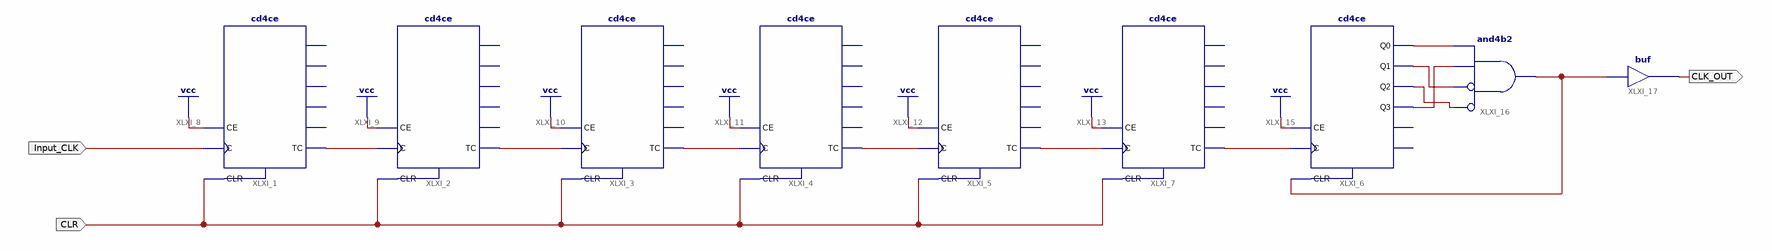
[diagram p0: schematic sheet 1]
// Xilinx ISE schematic Div9M.sch (spartan6) as structural Verilog: 9 symbols, 3 ports
module Div9M (
  input  Input_CLK,
  input  CLR,
  output CLK_OUT
);

  wire XLXN_2, XLXN_3, XLXN_4, XLXN_5, XLXN_6, XLXN_7, XLXN_20, XLXN_21, XLXN_22, XLXN_23, XLXN_24;

  cd4ce XLXI_1 (.C(Input_CLK), .CE(1'b1), .CLR(CLR), .TC(XLXN_2));  // open: CEO, Q0, Q1, Q2, Q3
  cd4ce XLXI_2 (.C(XLXN_2), .CE(1'b1), .CLR(CLR), .TC(XLXN_3));  // open: CEO, Q0, Q1, Q2, Q3
  cd4ce XLXI_3 (.C(XLXN_3), .CE(1'b1), .CLR(CLR), .TC(XLXN_4));  // open: CEO, Q0, Q1, Q2, Q3
  cd4ce XLXI_4 (.C(XLXN_4), .CE(1'b1), .CLR(CLR), .TC(XLXN_5));  // open: CEO, Q0, Q1, Q2, Q3
  cd4ce XLXI_5 (.C(XLXN_5), .CE(1'b1), .CLR(CLR), .TC(XLXN_6));  // open: CEO, Q0, Q1, Q2, Q3
  cd4ce XLXI_6 (
    .C(XLXN_7), .CE(1'b1), .CLR(XLXN_24), .Q0(XLXN_20), .Q1(XLXN_22), .Q2(XLXN_23), .Q3(XLXN_21));  // open: CEO, TC
  cd4ce XLXI_7 (.C(XLXN_6), .CE(1'b1), .CLR(CLR), .TC(XLXN_7));  // open: CEO, Q0, Q1, Q2, Q3
  and XLXI_16 (XLXN_24, ~XLXN_23, ~XLXN_22, XLXN_21, XLXN_20);  // and4b2
  buf XLXI_17 (CLK_OUT, XLXN_24);
endmodule
